# Altium schematic sheet analog_lvb_sense.SchDoc
size A
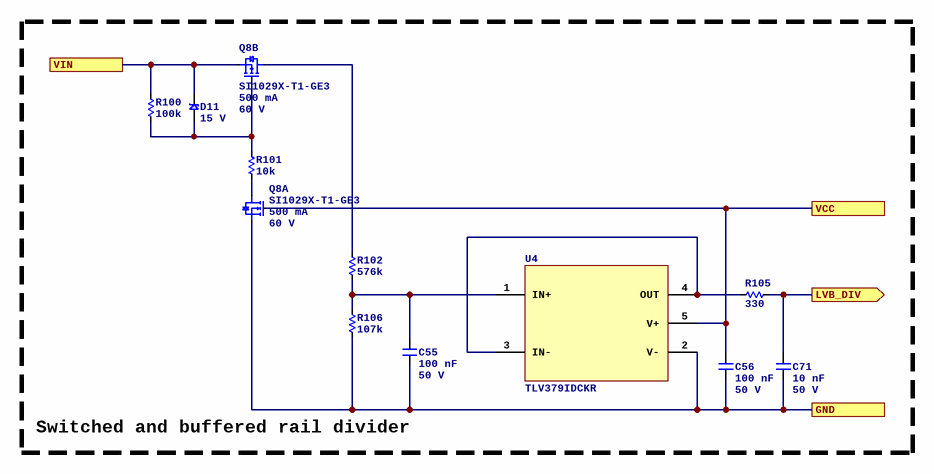
[diagram p0: analog_lvb_sense.SchDoc]

## Parts
C55  Capacitance: 100 nF  Voltage Rating: 50 V  [C0402]  (hidden comment: CL05B104KB54PNC)
C56  Capacitance: 100 nF  Voltage Rating: 50 V  [C0402]  (hidden comment: CL05B104KB54PNC)
C71  Capacitance: 10 nF  Voltage Rating: 50 V  [C0402]  (hidden comment: CL05B103KB5NNNC)
D11  Vr: 15 V  [SOD323]  (hidden comment: MM3Z15VC)
Q8  SI1029X-T1-GE3  Current: 500 mA  Voltage: 60 V  [6SOT563]  (parts A,B of 2)
R100  value 100k  [R0402]  (hidden comment: 0402WGF1003TCE)
R101  value 10k  [R0402]  (hidden comment: 0402WGF1002TCE)
R102  value 576k  [R0402]  (hidden comment: 0402WGF5763TCE)
R105  value 330  [R0402]  (hidden comment: 0402WGF3300TCE)
R106  value 107k  [R0402]  (hidden comment: 0402WGF1073TCE)
U4  TLV379IDCKR  [5SC70]

## Blocks framed on the sheet
Switched and buffered rail divider: C55 C56 C71 D11 Q8 R100-R102 R105 R106 U4

## Ports
GND, LVB_DIV (out), VCC, VIN

## Nets
GND: C55.2 C56.2 C71.2 Q8.1 R106.1 U4.2(V-) ; port GND
LVB_DIV: C71.1 R105.2 ; port LVB_DIV
VCC: C56.1 Q8.2 U4.5(V+) ; port VCC
VIN: D11.2 Q8.4 R100.1 ; port VIN
NetC55_1: C55.1 R102.1 R106.2 U4.1(IN+)
NetD11_1: D11.1 Q8.5 R100.2 R101.1
NetQ8_3: Q8.3 R102.2
NetQ8_6: Q8.6 R101.2
NetR105_1: R105.1 U4.3(IN-) U4.4(OUT)

## Library data of the parts
C55 C56 = CL05B104KB54PNC: Manufacturer: Samsung Electro-Mechanics; Dielectric: X7R; ComponentLink1URL: https://wmsc.lcsc.com/wmsc/upload/file/pdf/v2/lcsc/2304140030_Samsung-Electro-Mechanics-CL05B104KB54PNC_C307331.pdf; ComponentLink1Description: Datasheet; Manufacturer Part Number: CL05B104KB54PNC; Package: 0402; Supplier 2: LCSC; Supplier Part Number 2: C307331
C71 = CL05B103KB5NNNC: Manufacturer: Samsung Electro-Mechanics; Dielectric: X7R; ComponentLink1URL: https://wmsc.lcsc.com/wmsc/upload/file/pdf/v2/lcsc/2304140030_Samsung-Electro-Mechanics-CL05B103KB5NNNC_C15195.pdf; ComponentLink1Description: Datasheet; Manufacturer Part Number: CL05B103KB5NNNC; Package: 0402; Supplier 2: LCSC; Supplier Part Number 2: C15195
D11 = MM3Z15VC: DIODE ZENER 15V 200MW SOD; Manufacturer: onsemi; Current: 13.3 mA; Supplier 1: DigiKey; Manufacturer Part Number: MM3Z15VC; ComponentLink1URL: https://www.onsemi.com/pdf/datasheet/mm3z9v1c-d.pdf; ComponentLink1Description: Datasheet; Supplier Part Number 1: MM3Z15VCCT-ND; Supplier 2: LCSC; Supplier Part Number 2: C891582; Diode Type: Zener; Supplier 3: Mouser; Supplier Part Number 3: 512-MM3Z15VC
Q8 = SI1029X-T1-GE3: Small Signal Field-Effect Transistor, 0.305A I(D), 60V, 2-Element, N-Channel and P-Channel, Silicon, Metal-oxide Semiconductor FET; Manufacturer: Vishay Siliconix; Supplier 1: DigiKey; Supplier Part Number 1: SI1029X-T1-GE3CT-ND; Manufacturer Part Number: SI1029X-T1-GE3; ComponentLink1Description: Datasheet; ComponentLink1URL: https://www.vishay.com/docs/71435/si1029x.pdf; Supplier 2: LCSC; Supplier Part Number 2: C144890; Channel Type: N-channel and P-channel; Supplier 3: Mouser; Supplier Part Number 3: 781-SI1029X-T1-GE3
R100 = 0402WGF1003TCE: Manufacturer: UNI-ROYAL(Uniroyal Elec); Tolerance: 1%; Temperature Coefficient: ±100ppm/?; Power Rating (mW): 62.5; ComponentLink1Description: Datasheet; ComponentLink1URL: https://wmsc.lcsc.com/wmsc/upload/file/pdf/v2/lcsc/2206010100_UNI-ROYAL-Uniroyal-Elec-0402WGF1003TCE_C25741.pdf; Manufacturer Part Number: 0402WGF1003TCE; Package: 0402; Supplier 2: LCSC; Supplier Part Number 2: C25741
R101 = 0402WGF1002TCE: Manufacturer: UNI-ROYAL(Uniroyal Elec); Tolerance: 1%; Temperature Coefficient: ±100ppm/?; Power Rating (mW): 62.5; ComponentLink1Description: Datasheet; ComponentLink1URL: https://wmsc.lcsc.com/wmsc/upload/file/pdf/v2/lcsc/2206010100_UNI-ROYAL-Uniroyal-Elec-0402WGF1002TCE_C25744.pdf; Manufacturer Part Number: 0402WGF1002TCE; Package: 0402; Supplier 2: LCSC; Supplier Part Number 2: C25744
R102 = 0402WGF5763TCE: Manufacturer: UNI-ROYAL(Uniroyal Elec); Tolerance: 1%; Temperature Coefficient: ±100ppm/?; Power Rating (mW): 62.5; Manufacturer Part Number: 0402WGF5763TCE; ComponentLink1Description: Datasheet; ComponentLink1URL: https://wmsc.lcsc.com/wmsc/upload/file/pdf/v2/lcsc/2206010030_UNI-ROYAL-Uniroyal-Elec-0402WGF5763TCE_C27012.pdf; Package: 0402; Supplier 2: LCSC; Supplier Part Number 2: C27012
R105 = 0402WGF3300TCE: Manufacturer: UNI-ROYAL(Uniroyal Elec); Tolerance: 1%; Temperature Coefficient: ±100ppm/?; Power Rating (mW): 62.5; ComponentLink1Description: Datasheet; ComponentLink1URL: https://wmsc.lcsc.com/wmsc/upload/file/pdf/v2/lcsc/2205311900_UNI-ROYAL-Uniroyal-Elec-0402WGF3300TCE_C25104.pdf; Manufacturer Part Number: 0402WGF3300TCE; Package: 0402; Supplier 2: LCSC; Supplier Part Number 2: C25104
R106 = 0402WGF1073TCE: Manufacturer: UNI-ROYAL(Uniroyal Elec); Tolerance: 1%; Temperature Coefficient: ±100ppm/?; Power Rating (mW): 62.5; Manufacturer Part Number: 0402WGF1073TCE; ComponentLink1Description: Datasheet; ComponentLink1URL: https://wmsc.lcsc.com/wmsc/upload/file/pdf/v2/lcsc/2206010100_UNI-ROYAL-Uniroyal-Elec-0402WGF1073TCE_C25743.pdf; Package: 0402; Supplier 2: LCSC; Supplier Part Number 2: C25743
U4 = TLV379IDCKR: Low-Voltage, 4-µA, Rail-to-Rail I/O Operational Amplifier for Cost-Sensitive Systems 5-SC70 -40 to 125; Manufacturer: Texas Instruments; Supplier 1: DigiKey; Supplier Part Number 1: 296-47844-1-ND; Manufacturer Part Number: TLV379IDCKR; Supplier Part Number 2: C2860386; ComponentLink1Description: Datasheet; ComponentLink1URL: https://www.ti.com/lit/ds/symlink/tlv379.pdf; Supplier 2: LCSC; Supplier 3: Mouser; Supplier Part Number 3: 595-TLV379IDCKR